# EAGLE design PGA257_socket (EAGLE 9.6.2)
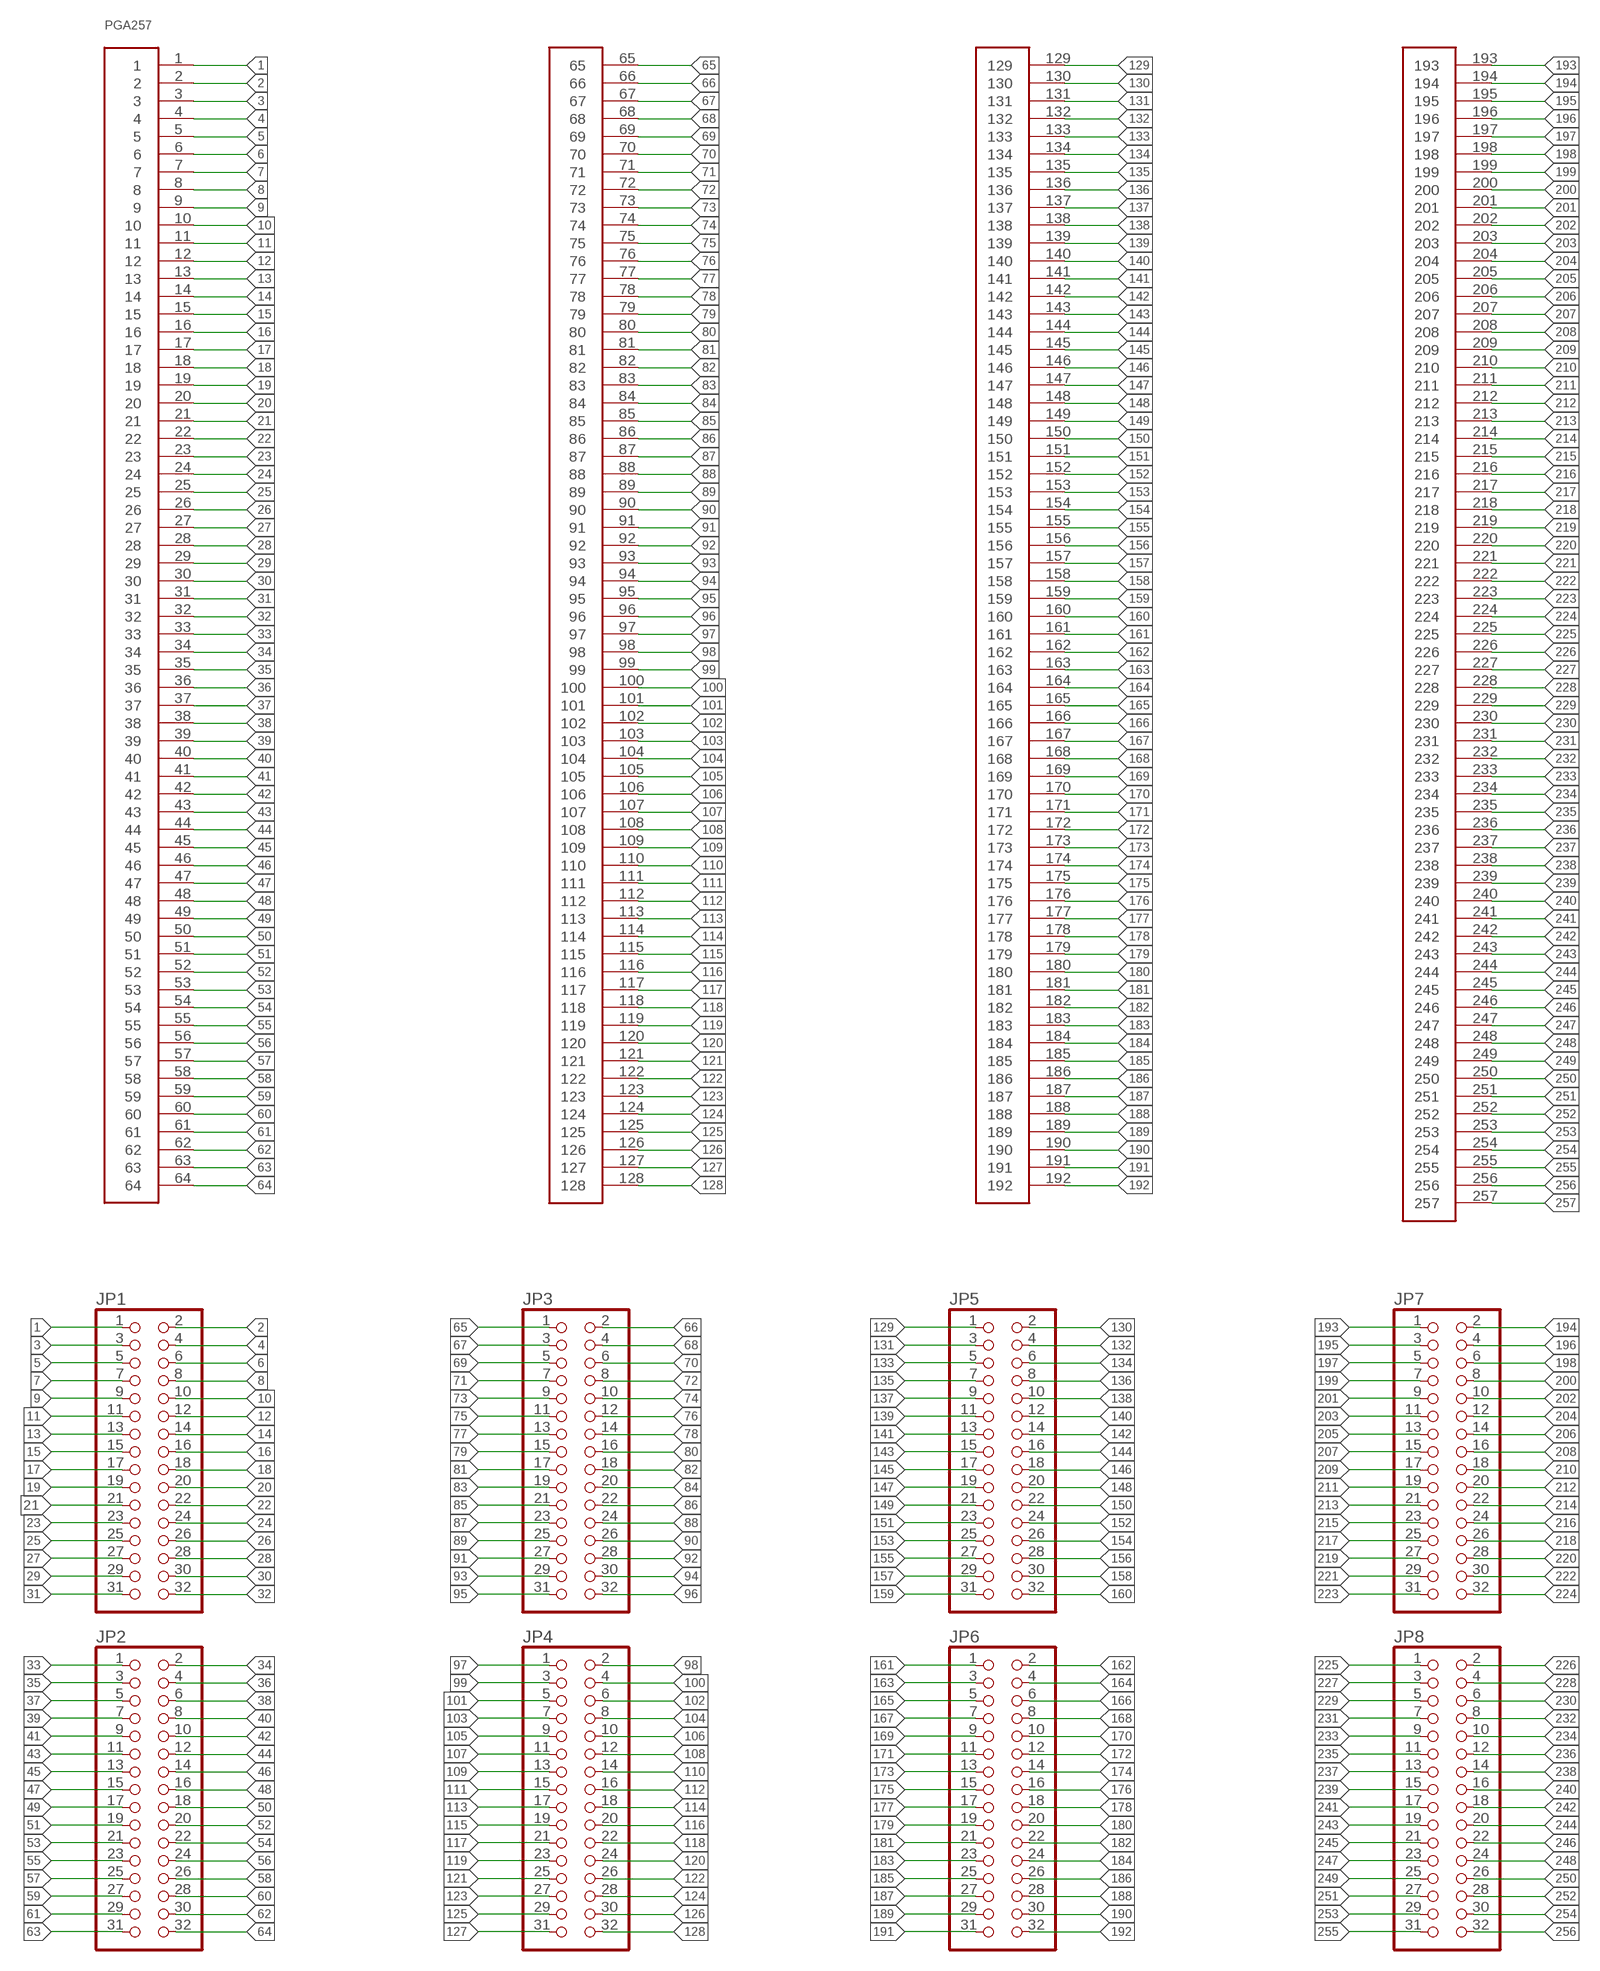
[diagram p0: schematic, sheet 1]

## Parts
JP1  PINHD-2X16  [2X16]
JP2  PINHD-2X16  [2X16]
JP3  PINHD-2X16  [2X16]
JP4  PINHD-2X16  [2X16]
JP5  PINHD-2X16  [2X16]
JP6  PINHD-2X16  [2X16]
JP7  PINHD-2X16  [2X16]
JP8  PINHD-2X16  [2X16]
PGA257  PGA257  [PGA257]

## Nets
1: JP1.1 PGA257.1
2: JP1.2 PGA257.2
3: JP1.3 PGA257.3
4: JP1.4 PGA257.4
5: JP1.5 PGA257.5
6: JP1.6 PGA257.6
7: JP1.7 PGA257.7
8: JP1.8 PGA257.8
9: JP1.9 PGA257.9
10: JP1.10 PGA257.10
11: JP1.11 PGA257.11
12: JP1.12 PGA257.12
13: JP1.13 PGA257.13
14: JP1.14 PGA257.14
15: JP1.15 PGA257.15
16: JP1.16 PGA257.16
17: JP1.17 PGA257.17
18: JP1.18 PGA257.18
19: JP1.19 PGA257.19
20: JP1.20 PGA257.20
21: JP1.21 PGA257.21
22: JP1.22 PGA257.22
23: JP1.23 PGA257.23
24: JP1.24 PGA257.24
25: JP1.25 PGA257.25
26: JP1.26 PGA257.26
27: JP1.27 PGA257.27
28: JP1.28 PGA257.28
29: JP1.29 PGA257.29
30: JP1.30 PGA257.30
31: JP1.31 PGA257.31
32: JP1.32 PGA257.32
33: JP2.1 PGA257.33
34: JP2.2 PGA257.34
35: JP2.3 PGA257.35
36: JP2.4 PGA257.36
37: JP2.5 PGA257.37
38: JP2.6 PGA257.38
39: JP2.7 PGA257.39
40: JP2.8 PGA257.40
41: JP2.9 PGA257.41
42: JP2.10 PGA257.42
43: JP2.11 PGA257.43
44: JP2.12 PGA257.44
45: JP2.13 PGA257.45
46: JP2.14 PGA257.46
47: JP2.15 PGA257.47
48: JP2.16 PGA257.48
49: JP2.17 PGA257.49
50: JP2.18 PGA257.50
51: JP2.19 PGA257.51
52: JP2.20 PGA257.52
53: JP2.21 PGA257.53
54: JP2.22 PGA257.54
55: JP2.23 PGA257.55
56: JP2.24 PGA257.56
57: JP2.25 PGA257.57
58: JP2.26 PGA257.58
59: JP2.27 PGA257.59
60: JP2.28 PGA257.60
61: JP2.29 PGA257.61
62: JP2.30 PGA257.62
63: JP2.31 PGA257.63
64: JP2.32 PGA257.64
65: JP3.1 PGA257.65
66: JP3.2 PGA257.66
67: JP3.3 PGA257.67
68: JP3.4 PGA257.68
69: JP3.5 PGA257.69
70: JP3.6 PGA257.70
71: JP3.7 PGA257.71
72: JP3.8 PGA257.72
73: JP3.9 PGA257.73
74: JP3.10 PGA257.74
75: JP3.11 PGA257.75
76: JP3.12 PGA257.76
77: JP3.13 PGA257.77
78: JP3.14 PGA257.78
79: JP3.15 PGA257.79
80: JP3.16 PGA257.80
81: JP3.17 PGA257.81
82: JP3.18 PGA257.82
83: JP3.19 PGA257.83
84: JP3.20 PGA257.84
85: JP3.21 PGA257.85
86: JP3.22 PGA257.86
87: JP3.23 PGA257.87
88: JP3.24 PGA257.88
89: JP3.25 PGA257.89
90: JP3.26 PGA257.90
91: JP3.27 PGA257.91
92: JP3.28 PGA257.92
93: JP3.29 PGA257.93
94: JP3.30 PGA257.94
95: JP3.31 PGA257.95
96: JP3.32 PGA257.96
97: JP4.1 PGA257.97
98: JP4.2 PGA257.98
99: JP4.3 PGA257.99
100: JP4.4 PGA257.100
101: JP4.5 PGA257.101
102: JP4.6 PGA257.102
103: JP4.7 PGA257.103
104: JP4.8 PGA257.104
105: JP4.9 PGA257.105
106: JP4.10 PGA257.106
107: JP4.11 PGA257.107
108: JP4.12 PGA257.108
109: JP4.13 PGA257.109
110: JP4.14 PGA257.110
111: JP4.15 PGA257.111
112: JP4.16 PGA257.112
113: JP4.17 PGA257.113
114: JP4.18 PGA257.114
115: JP4.19 PGA257.115
116: JP4.20 PGA257.116
117: JP4.21 PGA257.117
118: JP4.22 PGA257.118
119: JP4.23 PGA257.119
120: JP4.24 PGA257.120
121: JP4.25 PGA257.121
122: JP4.26 PGA257.122
123: JP4.27 PGA257.123
124: JP4.28 PGA257.124
125: JP4.29 PGA257.125
126: JP4.30 PGA257.126
127: JP4.31 PGA257.127
128: JP4.32 PGA257.128
129: JP5.1 PGA257.129
130: JP5.2 PGA257.130
131: JP5.3 PGA257.131
132: JP5.4 PGA257.132
133: JP5.5 PGA257.133
134: JP5.6 PGA257.134
135: JP5.7 PGA257.135
136: JP5.8 PGA257.136
137: JP5.9 PGA257.137
138: JP5.10 PGA257.138
139: JP5.11 PGA257.139
140: JP5.12 PGA257.140
141: JP5.13 PGA257.141
142: JP5.14 PGA257.142
143: JP5.15 PGA257.143
144: JP5.16 PGA257.144
145: JP5.17 PGA257.145
146: JP5.18 PGA257.146
147: JP5.19 PGA257.147
148: JP5.20 PGA257.148
149: JP5.21 PGA257.149
150: JP5.22 PGA257.150
151: JP5.23 PGA257.151
152: JP5.24 PGA257.152
153: JP5.25 PGA257.153
154: JP5.26 PGA257.154
155: JP5.27 PGA257.155
156: JP5.28 PGA257.156
157: JP5.29 PGA257.157
158: JP5.30 PGA257.158
159: JP5.31 PGA257.159
160: JP5.32 PGA257.160
161: JP6.1 PGA257.161
162: JP6.2 PGA257.162
163: JP6.3 PGA257.163
164: JP6.4 PGA257.164
165: JP6.5 PGA257.165
166: JP6.6 PGA257.166
167: JP6.7 PGA257.167
168: JP6.8 PGA257.168
169: JP6.9 PGA257.169
170: JP6.10 PGA257.170
171: JP6.11 PGA257.171
172: JP6.12 PGA257.172
173: JP6.13 PGA257.173
174: JP6.14 PGA257.174
175: JP6.15 PGA257.175
176: JP6.16 PGA257.176
177: JP6.17 PGA257.177
178: JP6.18 PGA257.178
179: JP6.19 PGA257.179
180: JP6.20 PGA257.180
181: JP6.21 PGA257.181
182: JP6.22 PGA257.182
183: JP6.23 PGA257.183
184: JP6.24 PGA257.184
185: JP6.25 PGA257.185
186: JP6.26 PGA257.186
187: JP6.27 PGA257.187
188: JP6.28 PGA257.188
189: JP6.29 PGA257.189
190: JP6.30 PGA257.190
191: JP6.31 PGA257.191
192: JP6.32 PGA257.192
193: JP7.1 PGA257.193
194: JP7.2 PGA257.194
195: JP7.3 PGA257.195
196: JP7.4 PGA257.196
197: JP7.5 PGA257.197
198: JP7.6 PGA257.198
199: JP7.7 PGA257.199
200: JP7.8 PGA257.200
201: JP7.9 PGA257.201
202: JP7.10 PGA257.202
203: JP7.11 PGA257.203
204: JP7.12 PGA257.204
205: JP7.13 PGA257.205
206: JP7.14 PGA257.206
207: JP7.15 PGA257.207
208: JP7.16 PGA257.208
209: JP7.17 PGA257.209
210: JP7.18 PGA257.210
211: JP7.19 PGA257.211
212: JP7.20 PGA257.212
213: JP7.21 PGA257.213
214: JP7.22 PGA257.214
215: JP7.23 PGA257.215
216: JP7.24 PGA257.216
217: JP7.25 PGA257.217
218: JP7.26 PGA257.218
219: JP7.27 PGA257.219
220: JP7.28 PGA257.220
221: JP7.29 PGA257.221
222: JP7.30 PGA257.222
223: JP7.31 PGA257.223
224: JP7.32 PGA257.224
225: JP8.1 PGA257.225
226: JP8.2 PGA257.226
227: JP8.3 PGA257.227
228: JP8.4 PGA257.228
229: JP8.5 PGA257.229
230: JP8.6 PGA257.230
231: JP8.7 PGA257.231
232: JP8.8 PGA257.232
233: JP8.9 PGA257.233
234: JP8.10 PGA257.234
235: JP8.11 PGA257.235
236: JP8.12 PGA257.236
237: JP8.13 PGA257.237
238: JP8.14 PGA257.238
239: JP8.15 PGA257.239
240: JP8.16 PGA257.240
241: JP8.17 PGA257.241
242: JP8.18 PGA257.242
243: JP8.19 PGA257.243
244: JP8.20 PGA257.244
245: JP8.21 PGA257.245
246: JP8.22 PGA257.246
247: JP8.23 PGA257.247
248: JP8.24 PGA257.248
249: JP8.25 PGA257.249
250: JP8.26 PGA257.250
251: JP8.27 PGA257.251
252: JP8.28 PGA257.252
253: JP8.29 PGA257.253
254: JP8.30 PGA257.254
255: JP8.31 PGA257.255
256: JP8.32 PGA257.256
257: PGA257.257

## Library data of the parts
JP1-JP8 = pinhead:PINHD-2X16: PIN HEADER
PGA257 = qfp160:PGA257

## Board
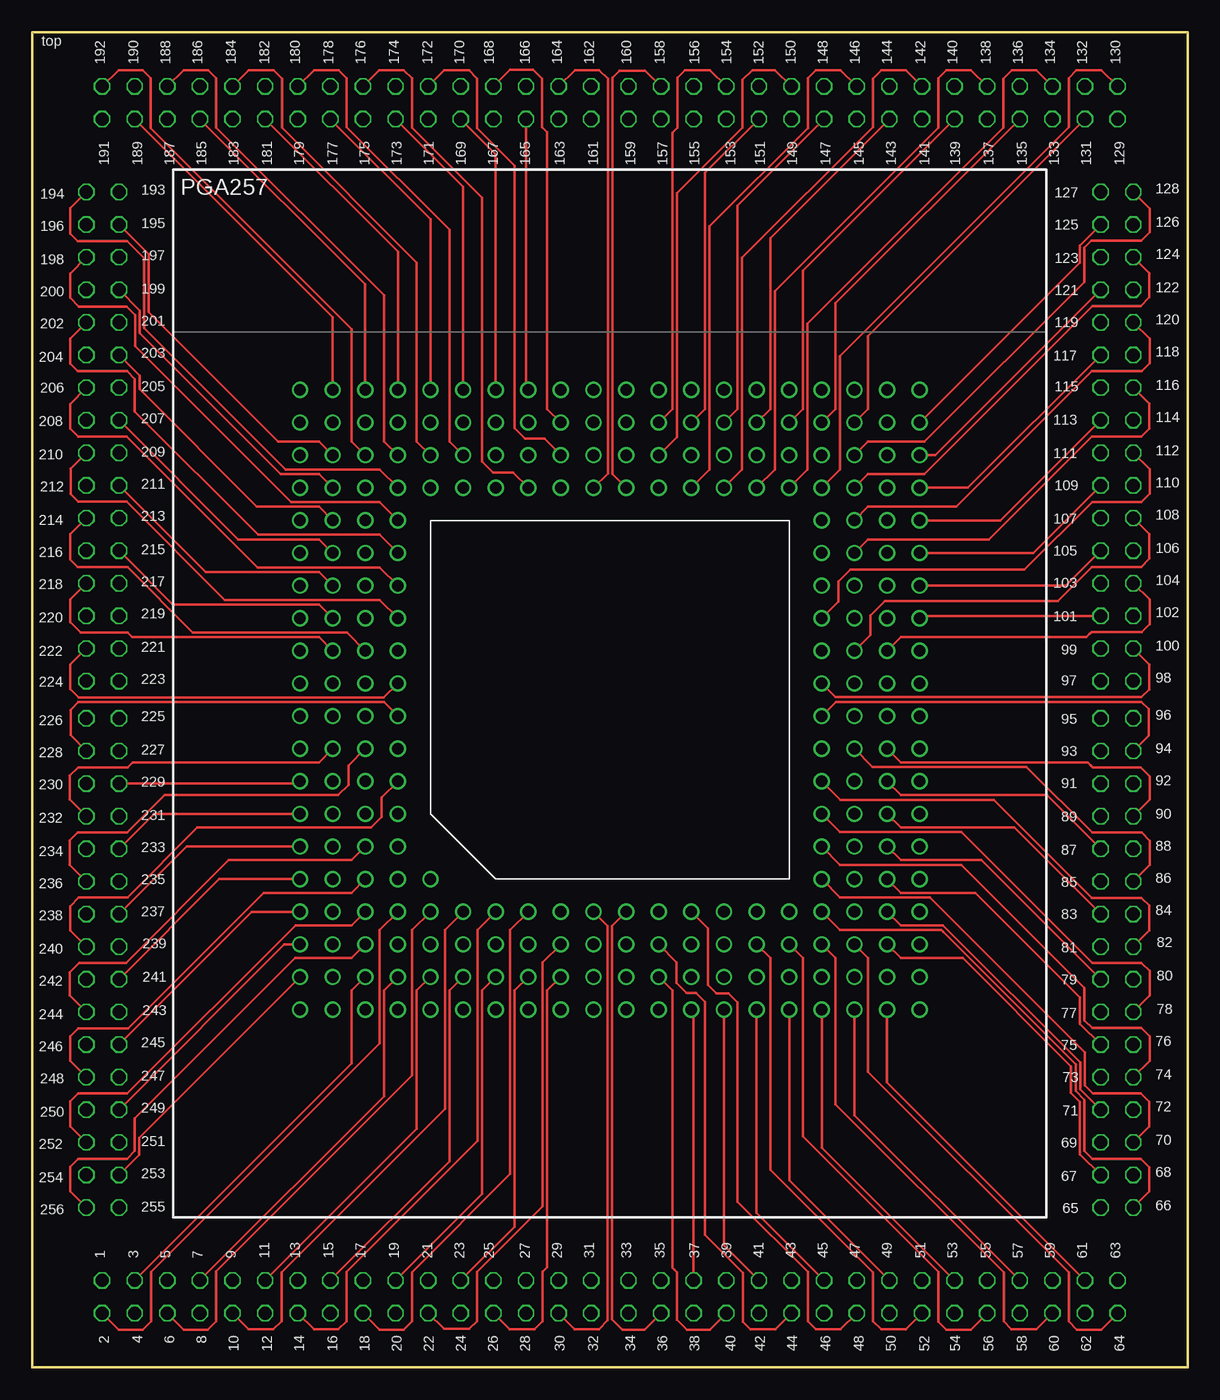
[diagram p1: board, top side]
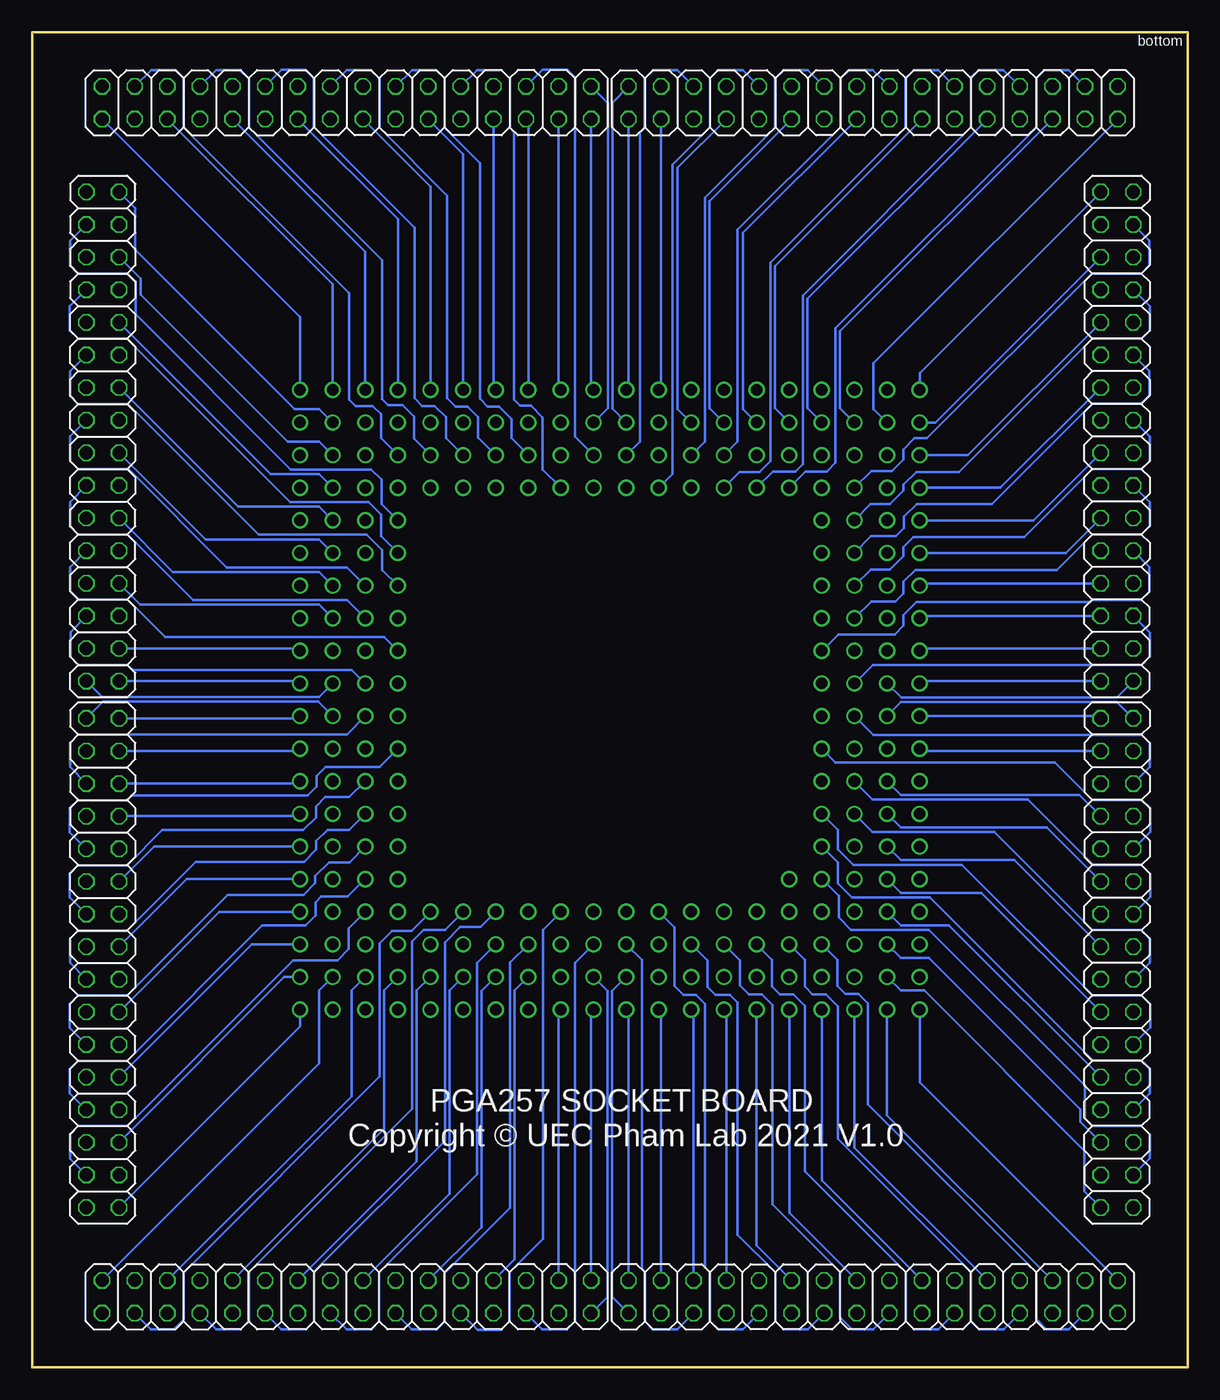
[diagram p2: board, bottom side, seen from below]

Size 90 x 104 mm. Coordinates in mm from the lower left corner, seen from the top.
Outline: 0,0 0,104 90,104 90,0 0,0
Copper layers (1*16): Top 0.035mm / dielectric 1.5mm / Bottom 0.035mm
Design rules "default *": minimum track width 6mil, minimum drill 0.35mm, track to track 6mil, track to pad 0.33mm, pad to pad 10mil, via to via 10mil, smd to smd 10mil, copper to edge 40mil, drill to drill 6mil, minimum pad ring 0.13mm, minimum via ring 0.13mm, stop-mask expansion 4mil, vias tented up to drill 0mil, thermal gap 10mil

### Footprints (pad centres in the part's own frame; a part is rotated, then mirrored left to right if it is on the bottom)
2X16 = drill 1.016 octagon: 1 -19.05,-1.27; 2 -19.05,1.27; 3 -16.51,-1.27; 4 -16.51,1.27; 5 -13.97,-1.27; 6 -13.97,1.27; 7 -11.43,-1.27; 8 -11.43,1.27; 9 -8.89,-1.27; 10 -8.89,1.27; 11 -6.35,-1.27; 12 -6.35,1.27; 13 -3.81,-1.27; 14 -3.81,1.27; 15 -1.27,-1.27; 16 -1.27,1.27; 17 1.27,-1.27; 18 1.27,1.27; 19 3.81,-1.27; 20 3.81,1.27; 21 6.35,-1.27; 22 6.35,1.27; 23 8.89,-1.27; 24 8.89,1.27; 25 11.43,-1.27; 26 11.43,1.27; 27 13.97,-1.27; 28 13.97,1.27; 29 16.51,-1.27; 30 16.51,1.27; 31 19.05,-1.27; 32 19.05,1.27
PGA257 = drill 0.9 pad 1.27: 1 -24.13,-24.13; 2 -16.51,-16.51; 3 -19.05,-21.59; 4 -16.51,-19.05; 5 -21.59,-24.13; 6 -13.97,-16.51; 7 -16.51,-21.59; 8 -13.97,-19.05; 9 -19.05,-24.13; 10 -11.43,-16.51; 11 -13.97,-21.59; 12 -11.43,-19.05; 13 -16.51,-24.13; 14 -8.89,-16.51; 15 -11.43,-21.59; 16 -8.89,-19.05; 17 -13.97,-24.13; 18 -6.35,-16.51; 19 -8.89,-21.59; 20 -6.35,-19.05; 21 -11.43,-24.13; 22 -3.81,-19.05; 23 -6.35,-21.59; 24 -3.81,-16.51; 25 -8.89,-24.13; 26 -3.81,-21.59; 27 -6.35,-24.13; 28 -1.27,-19.05; 29 -3.81,-24.13; 30 -1.27,-16.51; 31 -1.27,-24.13; 32 -1.27,-21.59; 33 1.27,-24.13; 34 1.27,-21.59; 35 3.81,-24.13; 36 1.27,-16.51; 37 6.35,-24.13; 38 1.27,-19.05; 39 6.35,-21.59; 40 3.81,-21.59; 41 8.89,-24.13; 42 3.81,-16.51; 43 8.89,-21.59; 44 3.81,-19.05; 45 11.43,-24.13; 46 6.35,-19.05; 47 11.43,-21.59; 48 6.35,-16.51; 49 13.97,-24.13; 50 8.89,-19.05; 51 13.97,-21.59; 52 11.43,-19.05; 53 16.51,-24.13; 54 8.89,-16.51; 55 16.51,-21.59; 56 13.97,-19.05; 57 19.05,-24.13; 58 11.43,-16.51; 59 19.05,-21.59; 60 16.51,-19.05; 61 21.59,-24.13; 62 13.97,-16.51; 63 21.59,-21.59; 64 19.05,-19.05; 65 24.13,-24.13; 66 16.51,-16.51; 67 21.59,-19.05; 68 19.05,-16.51; 69 24.13,-21.59; 70 16.51,-13.97; 71 21.59,-16.51; 72 19.05,-13.97; 73 24.13,-19.05; 74 16.51,-11.43; 75 21.59,-13.97; 76 19.05,-11.43; 77 24.13,-16.51; 78 16.51,-8.89; 79 21.59,-11.43; 80 19.05,-8.89; 81 24.13,-13.97; 82 16.51,-6.35; 83 21.59,-8.89; 84 19.05,-6.35; 85 24.13,-11.43; 86 19.05,-3.81; 87 21.59,-6.35; 88 16.51,-3.81; 89 24.13,-8.89; 90 21.59,-3.81; 91 24.13,-6.35; 92 19.05,-1.27; 93 24.13,-3.81; 94 16.51,-1.27; 95 24.13,-1.27; 96 21.59,-1.27; 97 24.13,1.27; 98 21.59,1.27; 99 24.13,3.81; 100 16.51,1.27; 101 24.13,6.35; 102 19.05,1.27; 103 21.59,6.35; 104 21.59,3.81; 105 24.13,8.89; 106 16.51,3.81; 107 21.59,8.89; 108 19.05,3.81; 109 24.13,11.43; 110 19.05,6.35; 111 21.59,11.43; 112 16.51,6.35; 113 24.13,13.97; 114 19.05,8.89; 115 21.59,13.97; 116 19.05,11.43; 117 24.13,16.51; 118 16.51,8.89; 119 21.59,16.51; 120 19.05,13.97; 121 24.13,19.05; 122 16.51,11.43; 123 21.59,19.05; 124 19.05,16.51; 125 24.13,21.59; 126 16.51,13.97; 127 21.59,21.59; 128 19.05,19.05; 129 24.13,24.13; 130 16.51,16.51; 131 19.05,21.59; 132 16.51,19.05; 133 21.59,24.13; 134 13.97,16.51; 135 16.51,21.59; 136 13.97,19.05; 137 19.05,24.13; 138 11.43,16.51; 139 13.97,21.59; 140 11.43,19.05; 141 16.51,24.13; 142 8.89,16.51; 143 11.43,21.59; 144 8.89,19.05; 145 13.97,24.13; 146 6.35,16.51; 147 8.89,21.59; 148 6.35,19.05; 149 11.43,24.13; 150 3.81,19.05; 151 6.35,21.59; 152 3.81,16.51; 153 8.89,24.13; 154 3.81,21.59; 155 6.35,24.13; 156 1.27,19.05; 157 3.81,24.13; 158 1.27,16.51; 159 1.27,24.13; 160 1.27,21.59; 161 -1.27,24.13; 162 -1.27,21.59; 163 -3.81,24.13; 164 -1.27,16.51; 165 -6.35,24.13; 166 -1.27,19.05; 167 -6.35,21.59; 168 -3.81,21.59; 169 -8.89,24.13; 170 -3.81,16.51; 171 -8.89,21.59; 172 -3.81,19.05; 173 -11.43,24.13; 174 -6.35,19.05; 175 -11.43,21.59; 176 -6.35,16.51; 177 -13.97,24.13; 178 -8.89,19.05; 179 -13.97,21.59; 180 -11.43,19.05; 181 -16.51,24.13; 182 -8.89,16.51; 183 -16.51,21.59; 184 -13.97,19.05; 185 -19.05,24.13; 186 -11.43,16.51; 187 -19.05,21.59; 188 -16.51,19.05; 189 -21.59,24.13; 190 -13.97,16.51; 191 -21.59,21.59; 192 -19.05,19.05; 193 -24.13,24.13; 194 -16.51,16.51; 195 -21.59,19.05; 196 -19.05,16.51; 197 -24.13,21.59; 198 -16.51,13.97; 199 -21.59,16.51; 200 -19.05,13.97; 201 -24.13,19.05; 202 -16.51,11.43; 203 -21.59,13.97; 204 -19.05,11.43; 205 -24.13,16.51; 206 -16.51,8.89; 207 -21.59,11.43; 208 -19.05,8.89; 209 -24.13,13.97; 210 -16.51,6.35; 211 -21.59,8.89; 212 -19.05,6.35; 213 -24.13,11.43; 214 -19.05,3.81; 215 -21.59,6.35; 216 -16.51,3.81; 217 -24.13,8.89; 218 -21.59,3.81; 219 -24.13,6.35; 220 -19.05,1.27; 221 -24.13,3.81; 222 -16.51,1.27; 223 -24.13,1.27; 224 -21.59,1.27; 225 -24.13,-1.27; 226 -21.59,-1.27; 227 -24.13,-3.81; 228 -16.51,-1.27; 229 -24.13,-6.35; 230 -19.05,-1.27; 231 -21.59,-6.35; 232 -21.59,-3.81; 233 -24.13,-8.89; 234 -16.51,-3.81; 235 -21.59,-8.89; 236 -19.05,-3.81; 237 -24.13,-11.43; 238 -19.05,-6.35; 239 -21.59,-11.43; 240 -16.51,-6.35; 241 -24.13,-13.97; 242 -19.05,-8.89; 243 -21.59,-13.97; 244 -19.05,-11.43; 245 -24.13,-16.51; 246 -16.51,-8.89; 247 -21.59,-16.51; 248 -19.05,-13.97; 249 -24.13,-19.05; 250 -16.51,-11.43; 251 -21.59,-19.05; 252 -19.05,-16.51; 253 -24.13,-21.59; 254 -16.51,-13.97; 255 -21.59,-21.59; 256 -19.05,-19.05; 257 -13.97,-13.97

### Placement (x,y rotation side)
JP1  24.5,5.5 180 bottom
JP2  65.5,5.5 180 bottom
JP3  84.5,31.5 90 bottom
JP4  84.5,72.5 90 bottom
JP5  65.5,98.5 0 bottom
JP6  24.5,98.5 0 bottom
JP7  5.5,72.5 270 bottom
JP8  5.5,31.5 270 bottom
PGA257  45,52 0 top

### Tracks (layer width: path | path; a pad name or v marks a point on that pad's centre or on a via)
1
  Bottom 0.2: JP1.1 20.87,22.19 PGA257.1
2
  Top 0.2: JP1.2 6.73,2.95 8.61,2.95 9.26,3.6 9.26,7.43 27.07,25.24 27.07,34.07 PGA257.2
3
  Top 0.2: JP1.3 24.89,23.66 24.89,29.34 PGA257.3
4
  Bottom 0.2: JP1.4 9.25,2.97 10.99,2.97 11.79,3.77 11.79,7.41 24.89,20.5 24.89,28.34 25.63,29.09 26.66,29.09 27.29,29.72 27.29,31.75 PGA257.4
5
  Bottom 0.2: JP1.5 23.41,19.65 PGA257.5
6
  Top 0.2: JP1.6 11.81,2.95 13.69,2.95 14.34,3.6 14.34,7.48 29.61,22.75 29.61,34.07 PGA257.6
7
  Top 0.2: JP1.7 27.43,21.12 27.43,29.34 PGA257.7
8
  Bottom 0.2: JP1.8 14.32,2.98 16.23,2.98 16.88,3.63 16.88,7.44 27.23,17.78 27.23,28.11 28.18,29.07 29.22,29.07 29.82,29.67 29.82,31.74 PGA257.8
9
  Bottom 0.2: JP1.9 25.95,17.11 PGA257.9
10
  Top 0.2: JP1.10 16.88,2.96 18.78,2.96 19.42,3.6 19.42,7.4 32.15,20.13 32.15,34.07 PGA257.10
11
  Top 0.2: JP1.11 29.96,18.59 29.96,29.34 PGA257.11
12
  Bottom 0.2: JP1.12 19.42,2.96 21.32,2.96 21.95,3.59 21.95,7.4 29.8,15.26 29.8,28.15 30.69,29.04 31.74,29.04 32.36,29.66 32.36,31.74 PGA257.12
13
  Bottom 0.2: JP1.13 28.49,14.57 PGA257.13
14
  Top 0.2: JP1.14 21.96,2.96 23.85,2.96 24.5,3.61 24.5,7.44 34.69,17.63 34.69,34.07 PGA257.14
15
  Top 0.2: JP1.15 32.51,16.05 32.51,29.34 PGA257.15
16
  Bottom 0.2: JP1.16 24.49,2.97 26.14,2.97 27.07,3.9 27.07,7.45 32.34,12.72 32.34,28.23 33.16,29.05 34.16,29.05 34.88,29.77 34.88,31.7 36.11,32.94 PGA257.16
17
  Bottom 0.2: JP1.17 31.03,12.03 PGA257.17
18
  Top 0.2: JP1.18 27.06,2.94 28.92,2.94 29.58,3.6 29.58,7.42 37.23,15.07 37.23,34.07 PGA257.18
19
  Top 0.2: JP1.19 35.05,13.51 35.05,29.34 PGA257.19
20
  Bottom 0.2: JP1.20 29.56,2.98 31.49,2.98 32.11,3.6 32.11,7.41 35.05,10.34 35.05,28.45 35.63,29.03 36.78,29.03 37.4,29.65 37.4,31.7 PGA257.20
21
  Bottom 0.2: JP1.21 33.57,9.49 PGA257.21
22
  Top 0.2: JP1.22 32.09,2.99 34.05,2.99 34.67,3.61 34.67,7.44 39.77,12.54 39.77,31.53 PGA257.22
23
  Top 0.2: PGA257.23 37.59,29.34 37.59,10.97 JP1.23
24
  Bottom 0.2: JP1.24 34.65,2.97 36.55,2.97 37.19,3.61 37.19,7.42 37.59,7.81 37.59,28.31 38.3,29.03 39.28,29.03 39.98,29.73 39.98,34.27 PGA257.24
25
  Bottom 0.2: JP1.25 35.93,27.69 PGA257.25
26
  Top 0.2: JP1.26 37.18,2.98 39.12,2.98 39.75,3.61 39.75,7.43 40.12,7.8 40.12,29.34 PGA257.26
27
  Bottom 0.2: JP1.27 38.47,27.69 PGA257.27
28
  Bottom 0.2: PGA257.28 42.51,31.73 42.51,7.67 42.28,7.45 42.28,3.58 41.66,2.96 39.74,2.96 JP1.28
29
  Bottom 0.2: JP1.29 41.01,27.69 PGA257.29
30
  Top 0.2: JP1.30 42.26,2.98 44.14,2.98 44.82,3.66 44.82,34.4 PGA257.30
31
  Bottom 0.2: JP1.31 43.55,27.69 PGA257.31
32
  Bottom 0.2: JP1.32 44.82,5.5 44.82,29.32 PGA257.32
33
  Bottom 0.2: PGA257.33 46.45,27.69 JP2.1
34
  Bottom 0.2: JP2.2 45.17,5.51 45.17,29.31 PGA257.34
35
  Bottom 0.2: JP2.3 48.99,27.69 PGA257.35
36
  Top 0.2: JP2.4 47.68,2.93 45.98,2.93 45.17,3.74 45.17,34.39 PGA257.36
37
  Top 0.2: JP2.5 51.53,27.69 PGA257.37
38
  Bottom 0.2: JP2.6 50.28,2.98 48.33,2.98 47.72,3.59 47.72,31.5 PGA257.38
39
  Bottom 0.2: PGA257.39 52.41,29.34 52.41,8.42 JP2.7
40
  Top 0.2: JP2.8 52.79,2.95 51,2.95 50.24,3.71 50.24,7.4 50.02,7.62 49.88,7.77 49.88,29.34 PGA257.40
41
  Top 0.2: JP2.9 53.89,9.49 PGA257.41
42
  Bottom 0.2: PGA257.42 50.22,34.08 50.22,30.16 50.22,30.03 50.22,10.01 52.82,7.41 52.82,3.6 53.49,2.93 55.31,2.93 JP2.10
43
  Bottom 0.2: JP2.11 54.99,10.92 54.99,29.3 PGA257.43
44
  Top 0.2: JP2.12 57.88,2.96 55.96,2.96 55.37,3.55 55.37,7.38 52.41,10.34 52.41,28.48 51.73,29.18 50.98,29.18 50.2,29.95 50.2,31.56 PGA257.44
45
  Top 0.2: JP2.13 56.43,12.03 PGA257.45
46
  Bottom 0.2: JP2.14 60.43,2.97 58.47,2.97 57.87,3.57 57.87,7.34 52.77,12.44 52.77,31.53 PGA257.46
47
  Bottom 0.2: JP2.15 57.49,13.51 57.49,29.34 PGA257.47
48
  Top 0.2: JP2.16 62.96,2.96 61.05,2.96 60.41,3.6 60.41,7.45 54.95,12.91 54.95,28.43 54.24,29.14 53.32,29.14 52.65,29.81 52.65,34.19 PGA257.48
49
  Top 0.2: JP2.17 58.97,14.57 PGA257.49
50
  Bottom 0.2: JP2.18 65.52,2.98 63.57,2.98 62.97,3.58 62.97,7.4 55.35,15.02 55.35,31.49 PGA257.50
51
  Bottom 0.2: JP2.19 60.03,16.05 60.03,29.34 PGA257.51
52
  Top 0.2: JP2.20 68.04,2.96 66.14,2.96 65.49,3.61 65.49,7.41 57.49,15.41 57.49,31.89 PGA257.52
53
  Top 0.2: JP2.21 61.51,17.11 PGA257.53
54
  Bottom 0.2: JP2.22 70.59,2.97 68.67,2.97 68.04,3.6 68.04,7.47 57.85,17.66 57.85,22.56 57.85,23.26 57.85,33.1 56.65,34.3 55.08,34.3 PGA257.54
55
  Bottom 0.2: JP2.23 62.58,18.59 62.58,29.34 PGA257.55
56
  Top 0.2: JP2.24 73.11,2.95 71.21,2.95 70.59,3.57 70.59,7.45 60.03,18.01 60.03,31.89 PGA257.56
57
  Top 0.2: JP2.25 64.05,19.65 PGA257.57
58
  Bottom 0.2: JP2.26 75.66,2.96 73.74,2.96 73.11,3.59 73.11,7.43 60.39,20.15 60.39,33.19 59.51,34.07 57.85,34.07 PGA257.58
59
  Bottom 0.2: JP2.27 65.11,21.12 65.11,29.34 PGA257.59
60
  Top 0.2: JP2.28 78.21,2.97 76.29,2.97 75.68,3.58 75.68,7.39 62.58,20.5 62.58,31.89 PGA257.60
61
  Top 0.2: JP2.29 66.59,22.19 PGA257.61
62
  Bottom 0.2: JP2.30 80.75,2.97 78.97,2.97 78.21,3.73 78.21,7.38 62.93,22.66 62.93,33.04 61.95,34.02 60.45,34.02 PGA257.62
63
  Bottom 0.2: JP2.31 67.66,23.66 67.66,29.34 PGA257.63
64
  Top 0.2: JP2.32 83.27,2.95 81.39,2.95 80.74,3.6 80.74,7.39 65.11,23.02 65.11,31.89 PGA257.64
65
  Bottom 0.2: JP3.1 69.13,26.55 PGA257.65
66
  Top 0.2: JP3.2 87.03,13.71 87.03,15.59 86.36,16.26 82.57,16.26 81.97,16.86 81.97,20.83 81.28,21.53 81.28,23.6 70.98,33.9 70.94,33.94 70.81,34.07 62.93,34.07 PGA257.66
67
  Top 0.2: JP3.3 81.62,16.6 81.62,20.69 80.92,21.38 80.92,23.46 72.5,31.89 67.66,31.89 PGA257.67
68
  Bottom 0.2: JP3.4 87.04,16.26 87.04,18.19 86.42,18.81 82.55,18.81 69.66,31.7 66.22,31.7 65.34,32.58 65.34,34.2 PGA257.68
69
  Bottom 0.2: JP3.5 70.35,30.41 PGA257.69
70
  Top 0.2: JP3.6 87.03,18.79 87.03,20.67 86.37,21.33 82.61,21.33 81.98,21.96 81.98,24.54 69.91,36.61 62.93,36.61 PGA257.70
71
  Top 0.2: JP3.7 81.63,21.67 81.63,23.75 70.95,34.42 67.66,34.42 PGA257.71
72
  Bottom 0.2: JP3.8 87.06,21.36 87.06,23.25 86.43,23.88 82.61,23.88 72.06,34.42 68.69,34.42 67.93,35.18 67.93,36.23 67.49,36.67 65.41,36.67 PGA257.72
73
  Bottom 0.2: JP3.9 72.89,32.95 PGA257.73
74
  Top 0.2: JP3.10 87.04,23.88 87.04,25.79 86.4,26.43 82.58,26.43 81.97,27.04 81.97,29.57 72.39,39.15 62.93,39.15 PGA257.74
75
  Top 0.2: JP3.11 81.62,26.76 81.62,28.83 73.48,36.97 67.66,36.97 PGA257.75
76
  Bottom 0.2: JP3.12 87.06,26.44 87.06,28.32 86.42,28.96 82.6,28.96 74.76,36.8 68.85,36.8 67.94,37.71 67.94,38.26 66.86,39.34 65.28,39.34 PGA257.76
77
  Bottom 0.2: JP3.13 75.43,35.49 PGA257.77
78
  Top 0.2: JP3.14 87.05,28.97 87.05,30.88 86.41,31.52 82.57,31.52 72.4,41.69 62.93,41.69 PGA257.78
79
  Top 0.2: JP3.15 73.95,39.51 67.66,39.51 PGA257.79
80
  Bottom 0.2: JP3.16 87.03,31.49 87.03,33.42 86.44,34.01 82.62,34.01 77.26,39.37 68.82,39.37 67.86,40.33 67.86,40.99 66.99,41.86 65.3,41.86 PGA257.80
81
  Bottom 0.2: JP3.17 77.97,38.03 PGA257.81
82
  Top 0.2: JP3.18 87.02,34.02 87.02,35.97 86.41,36.58 82.52,36.58 74.91,44.2 62.97,44.2 PGA257.82
83
  Top 0.2: JP3.19 76.5,42.05 67.66,42.05 PGA257.83
84
  Bottom 0.2: JP3.20 87.07,36.61 87.07,38.48 86.44,39.11 82.6,39.11 79.85,41.86 68.87,41.86 67.89,42.84 67.89,43.7 67.18,44.41 65.29,44.41 PGA257.84
85
  Bottom 0.2: JP3.21 80.51,40.57 PGA257.85
86
  Top 0.2: JP3.22 87.07,39.15 87.07,41.02 86.43,41.66 82.57,41.66 77.46,46.77 65.47,46.77 PGA257.86
87
  Top 0.2: JP3.23 79.03,44.59 67.66,44.59 PGA257.87
88
  Bottom 0.2: JP3.24 87.06,41.68 87.06,43.56 86.45,44.17 82.6,44.17 82.23,44.54 68.55,44.54 67.85,45.24 67.85,46.06 67.13,46.78 62.92,46.78 PGA257.88
89
  Bottom 0.2: JP3.25 69.31,42.93 PGA257.89
90
  Top 0.2: JP3.26 87.07,44.23 87.07,46.04 86.37,46.74 82.61,46.74 82.49,46.86 82.42,46.93 82.22,47.12 67.66,47.12 PGA257.90
91
  Bottom 0.2: JP3.27 69.31,45.47 PGA257.91
92
  Bottom 0.2: JP3.28 87.05,46.75 87.05,48.64 86.39,49.3 65.48,49.3 PGA257.92
93
  Bottom 0.2: JP3.29 69.31,48.01 PGA257.93
94
  Top 0.2: PGA257.94 62.62,51.84 86.39,51.84 86.96,51.27 86.96,49.2 JP3.30
95
  Bottom 0.2: JP3.31 69.31,50.55 PGA257.95
96
  Bottom 0.2: JP3.32 84.47,51.85 67.71,51.85 PGA257.96
97
  Bottom 0.2: JP4.1 69.31,53.45 PGA257.97
98
  Bottom 0.2: JP4.2 84.52,52.2 67.66,52.2 PGA257.98
99
  Bottom 0.2: PGA257.99 69.31,55.99 JP4.3
100
  Top 0.2: JP4.4 87.01,54.75 87.01,52.81 86.41,52.2 62.58,52.2 PGA257.100
101
  Top 0.2: PGA257.101 69.31,58.53 JP4.5
102
  Bottom 0.2: JP4.6 87.01,57.29 87.01,55.33 86.38,54.7 82.54,54.7 82.25,54.41 82.17,54.34 65.11,54.34 PGA257.102
103
  Bottom 0.2: JP4.7 81.58,59.41 67.66,59.41 PGA257.103
104
  Top 0.2: JP4.8 87.05,59.79 87.05,57.89 86.44,57.28 82.52,57.28 82.36,57.12 82.12,56.88 67.66,56.88 PGA257.104
105
  Top 0.2: JP4.9 80.51,60.89 PGA257.105
106
  Bottom 0.2: JP4.10 87.04,62.34 87.04,60.47 86.36,59.79 82.54,59.79 79.62,56.88 62.58,56.88 PGA257.106
107
  Bottom 0.2: JP4.11 79.03,61.95 67.66,61.95 PGA257.107
108
  Top 0.2: JP4.12 87.02,64.9 87.02,62.98 86.38,62.34 82.55,62.34 79.88,59.67 66.41,59.67 65.28,58.55 65.28,57.04 PGA257.108
109
  Top 0.2: JP4.13 77.97,63.43 PGA257.109
110
  Bottom 0.2: JP4.14 87.05,67.41 87.05,65.5 86.42,64.87 82.57,64.87 77.47,59.77 65.47,59.77 PGA257.110
111
  Bottom 0.2: JP4.15 76.5,64.5 67.66,64.5 PGA257.111
112
  Top 0.2: JP4.16 87.04,69.96 87.04,68.05 86.4,67.41 82.56,67.41 77.28,62.13 63.72,62.13 62.81,61.22 62.81,59.65 PGA257.112
113
  Top 0.2: JP4.17 75.43,65.97 PGA257.113
114
  Bottom 0.2: JP4.18 87.02,72.52 87.02,70.57 86.41,69.96 82.48,69.96 74.83,62.31 65.47,62.31 PGA257.114
115
  Bottom 0.2: JP4.19 73.95,67.03 67.66,67.03 PGA257.115
116
  Top 0.2: JP4.20 87.02,75.06 87.02,73.12 86.4,72.5 82.53,72.5 74.53,64.5 65.11,64.5 PGA257.116
117
  Top 0.2: JP4.21 72.89,68.51 PGA257.117
118
  Bottom 0.2: JP4.22 87.03,77.59 87.03,75.63 86.43,75.03 82.53,75.03 72.35,64.85 63.94,64.85 62.74,63.65 62.74,62.12 PGA257.118
119
  Bottom 0.2: JP4.23 71.41,69.58 67.66,69.58 PGA257.119
120
  Top 0.2: JP4.24 87.04,80.12 87.04,78.21 86.42,77.59 82.55,77.59 72,67.03 65.11,67.03 PGA257.120
121
  Top 0.2: JP4.25 70.35,71.05 PGA257.121
122
  Bottom 0.2: JP4.26 87.06,82.64 87.06,80.76 86.42,80.12 82.62,80.12 69.89,67.39 63.78,67.39 62.81,66.42 62.81,64.73 PGA257.122
123
  Bottom 0.2: JP4.27 81.56,84.8 81.56,83.56 70.11,72.11 67.66,72.11 PGA257.123
124
  Top 0.2: JP4.28 87.03,85.21 87.03,83.35 86.34,82.66 82.57,82.66 69.48,69.58 65.11,69.58 PGA257.124
125
  Top 0.2: JP4.29 81.59,87.37 81.59,86.05 PGA257.125
126
  Bottom 0.2: JP4.30 87.04,87.74 87.04,85.79 86.44,85.19 82.56,85.19 81.93,84.56 81.93,84.47 81.95,84.45 81.95,82.02 69.86,69.93 63.58,69.93 62.79,69.14 62.79,67.25 PGA257.126
127
  Bottom 0.2: JP4.31 81.97,90.29 81.97,87.06 69.56,74.66 67.66,74.66 PGA257.127
128
  Top 0.2: JP4.32 87.07,90.25 87.07,88.43 86.39,87.75 82.49,87.75 81.94,87.2 81.94,84.54 69.52,72.11 65.11,72.11 PGA257.128
129
  Bottom 0.2: JP5.1 69.13,81.81 PGA257.129
130
  Top 0.2: JP5.2 83.29,101.03 81.35,101.03 80.74,100.42 80.74,96.59 62.93,78.78 62.93,69.93 PGA257.130
131
  Top 0.2: JP5.3 65.11,80.34 65.11,74.66 PGA257.131
132
  Bottom 0.2: JP5.4 80.73,101.05 78.84,101.05 78.19,100.4 78.19,96.54 65.32,83.67 65.32,75.37 64.81,74.86 63.46,74.86 62.83,74.23 62.83,72.37 PGA257.132
133
  Bottom 0.2: JP5.5 66.59,84.35 PGA257.133
134
  Top 0.2: JP5.6 78.2,101.04 76.33,101.04 75.66,100.37 75.66,96.56 60.39,81.29 60.39,69.93 PGA257.134
135
  Top 0.2: JP5.7 62.58,82.88 62.58,74.66 PGA257.135
136
  Bottom 0.2: JP5.8 75.66,101.04 73.82,101.04 73.1,100.32 73.1,96.57 62.75,86.22 62.75,75.43 62.27,74.95 61.15,74.95 60.26,74.06 60.26,72.34 PGA257.136
137
  Bottom 0.2: JP5.9 64.05,86.89 PGA257.137
138
  Top 0.2: JP5.10 73.13,101.03 71.2,101.03 70.58,100.41 70.58,96.57 57.85,83.84 57.85,69.93 PGA257.138
139
  Top 0.2: JP5.11 60.03,85.41 60.03,74.66 PGA257.139
140
  Bottom 0.2: JP5.12 70.55,101.07 68.74,101.07 68.06,100.39 68.06,96.62 60.22,88.78 60.22,75.48 59.62,74.88 58.65,74.88 57.77,74 57.77,72.39 PGA257.140
141
  Bottom 0.2: JP5.13 61.51,89.43 PGA257.141
142
  Top 0.2: JP5.14 68.04,101.04 66.15,101.04 65.49,100.38 65.49,96.6 55.31,86.42 55.31,69.93 PGA257.142
143
  Top 0.2: JP5.15 57.49,87.95 57.49,74.66 PGA257.143
144
  Bottom 0.2: JP5.16 65.5,101.04 63.62,101.04 62.95,100.37 62.95,96.55 57.67,91.27 57.67,75.5 57.02,74.85 56.1,74.85 55.25,74 55.25,72.41 PGA257.144
145
  Bottom 0.2: JP5.17 58.97,91.97 PGA257.145
146
  Top 0.2: JP5.18 62.97,101.03 61.04,101.03 60.42,100.41 60.42,96.53 52.77,88.88 52.77,69.93 PGA257.146
147
  Top 0.2: JP5.19 54.95,90.5 54.95,74.66 PGA257.147
148
  Bottom 0.2: JP5.20 60.41,101.05 58.52,101.05 57.89,100.42 57.89,96.57 55.12,93.8 55.12,75.44 54.53,74.85 53.64,74.85 52.66,73.87 52.66,72.36 PGA257.148
149
  Bottom 0.2: JP5.21 56.43,94.51 PGA257.149
150
  Top 0.2: JP5.22 57.87,101.05 56.11,101.05 55.34,100.28 55.34,96.55 50.23,91.44 50.23,72.47 PGA257.150
151
  Top 0.2: JP5.23 52.41,93.03 52.41,74.66 PGA257.151
152
  Bottom 0.2: JP5.24 55.34,101.04 53.45,101.04 52.79,100.38 52.79,96.55 52.46,96.22 52.46,75.38 51.98,74.9 51.15,74.9 50.23,73.98 50.23,69.93 PGA257.152
153
  Bottom 0.2: JP5.25 54.07,76.31 PGA257.153
154
  Top 0.2: JP5.26 52.81,101.03 50.85,101.03 50.27,100.45 50.27,96.56 49.88,96.16 49.88,74.66 PGA257.154
155
  Bottom 0.2: JP5.27 51.35,97.05 PGA257.155
156
  Bottom 0.2: JP5.28 50.23,101.07 48.3,101.07 47.73,100.5 47.73,72.51 PGA257.156
157
  Bottom 0.2: JP5.29 48.99,76.31 PGA257.157
158
  Top 0.2: PGA257.158 45.19,69.59 45.19,100.43 45.77,101.01 47.75,101.01 JP5.30
159
  Bottom 0.2: JP5.31 46.45,76.31 PGA257.159
160
  Bottom 0.2: JP5.32 45.16,98.48 45.16,74.7 PGA257.160
161
  Bottom 0.2: JP6.1 43.55,76.31 PGA257.161
162
  Bottom 0.2: JP6.2 44.81,98.51 44.81,74.67 PGA257.162
163
  Bottom 0.2: JP6.3 41.01,76.31 PGA257.163
164
  Top 0.2: PGA257.164 44.84,69.62 44.84,100.35 44.14,101.05 42.29,101.05 JP6.4
165
  Top 0.2: JP6.5 38.47,76.31 PGA257.165
166
  Bottom 0.2: PGA257.166 42.66,72.11 42.66,96.17 42.31,96.53 42.31,100.35 41.61,101.05 39.75,101.05 JP6.6
167
  Bottom 0.2: PGA257.167 39.72,74.66 39.72,93.44 JP6.7
168
  Top 0.2: JP6.8 37.22,101.06 39.02,101.06 39.73,100.35 39.73,96.6 40.12,96.2 40.12,74.66 PGA257.168
169
  Top 0.2: JP6.9 36.11,94.51 PGA257.169
170
  Bottom 0.2: JP6.10 34.65,101.03 36.59,101.03 37.2,100.42 37.2,96.61 40.12,93.69 40.12,69.58 PGA257.170
171
  Bottom 0.2: JP6.11 37.23,90.85 37.23,74.71 PGA257.171
172
  Top 0.2: JP6.12 32.1,101.02 34.02,101.02 34.67,100.37 34.67,96.51 37.59,93.59 37.59,73.15 38.39,72.34 39.9,72.34 PGA257.172
173
  Top 0.2: JP6.13 33.57,91.97 PGA257.173
174
  Bottom 0.2: JP6.14 29.58,101.04 31.46,101.04 32.13,100.37 32.13,96.55 37.59,91.09 37.59,72.11 PGA257.174
175
  Bottom 0.2: JP6.15 34.63,88.37 34.63,74.66 PGA257.175
176
  Top 0.2: JP6.16 27.04,101.04 28.95,101.04 29.6,100.39 29.6,96.55 35.05,91.1 35.05,70.56 35.91,69.69 37.47,69.69 PGA257.176
177
  Top 0.2: JP6.17 31.03,89.43 PGA257.177
178
  Bottom 0.2: JP6.18 24.51,101.05 26.36,101.05 27.06,100.35 27.06,96.58 35.05,88.59 35.05,72.11 PGA257.178
179
  Bottom 0.2: JP6.19 32.15,85.77 32.15,74.71 PGA257.179
180
  Top 0.2: JP6.20 21.96,101.04 23.88,101.04 24.51,100.41 24.51,96.59 32.51,88.59 32.51,72.11 PGA257.180
181
  Top 0.2: JP6.21 28.49,86.89 PGA257.181
182
  Bottom 0.2: JP6.22 19.43,101.05 21.33,101.05 21.98,100.4 21.98,96.57 32.51,86.05 32.51,70.58 33.36,69.72 34.9,69.72 PGA257.182
183
  Bottom 0.2: JP6.23 29.61,83.23 29.61,74.71 PGA257.183
184
  Top 0.2: JP6.24 16.88,101.04 18.8,101.04 19.46,100.38 19.46,96.56 29.96,86.06 29.96,72.11 PGA257.184
185
  Top 0.2: JP6.25 25.95,84.35 PGA257.185
186
  Bottom 0.2: PGA257.186 32.31,69.77 30.56,69.77 29.96,70.36 29.96,83.48 16.87,96.58 16.87,100.47 16.29,101.05 14.35,101.05 JP6.26
187
  Bottom 0.2: PGA257.187 27.07,74.71 27.07,80.69 JP6.27
188
  Top 0.2: JP6.28 11.8,101.04 13.7,101.04 14.35,100.39 14.35,96.57 27.43,83.5 27.43,72.11 PGA257.188
189
  Top 0.2: JP6.29 23.41,81.81 PGA257.189
190
  Bottom 0.2: PGA257.190 29.75,69.79 28.11,69.79 27.42,70.48 27.42,80.93 11.78,96.57 11.78,100.46 11.19,101.05 9.27,101.05 JP6.30
191
  Bottom 0.2: JP6.31 24.48,78.2 24.48,74.66 PGA257.191
192
  Top 0.2: JP6.32 6.73,101.05 8.61,101.05 9.25,100.41 9.25,96.51 24.89,80.88 24.89,72.11 PGA257.192
193
  Bottom 0.2: JP7.1 20.87,77.45 PGA257.193
194
  Top 0.2: JP7.2 2.98,90.3 2.98,88.32 3.57,87.73 7.4,87.73 8.73,86.4 8.73,80.94 19.75,69.93 27.07,69.93 PGA257.194
195
  Top 0.2: JP7.3 9.09,86.69 9.09,82.18 19.15,72.11 22.34,72.11 PGA257.195
196
  Bottom 0.2: JP7.4 2.97,87.75 2.97,85.84 3.61,85.2 7.46,85.2 20.3,72.36 21.27,72.36 22.15,71.48 22.15,70.72 23.05,69.82 24.64,69.82 PGA257.196
197
  Bottom 0.2: JP7.5 19.65,73.59 PGA257.197
198
  Top 0.2: JP7.6 2.96,85.2 2.96,83.31 3.64,82.63 7.36,82.63 8.03,81.96 8.03,79.53 20.17,67.39 27.07,67.39 PGA257.198
199
  Top 0.2: JP7.7 8.38,82.32 8.38,80.54 19.35,69.58 22.34,69.58 PGA257.199
200
  Bottom 0.2: JP7.8 2.96,82.66 2.96,80.74 3.56,80.14 7.42,80.14 17.81,69.75 21.14,69.75 22.13,68.76 22.13,68.28 23.18,67.23 24.69,67.23 PGA257.200
201
  Bottom 0.2: JP7.9 17.11,71.05 PGA257.201
202
  Top 0.2: JP7.10 2.97,80.13 2.97,78.18 3.56,77.59 7.39,77.59 8.01,76.97 8.01,74.43 17.59,64.85 27.07,64.85 PGA257.202
203
  Top 0.2: JP7.11 8.36,77.26 8.36,76.18 17.51,67.03 22.34,67.03 PGA257.203
204
  Bottom 0.2: JP7.12 2.97,77.59 2.97,75.71 3.63,75.05 7.44,75.05 15.24,67.25 21.1,67.25 22.08,66.27 22.08,65.38 22.73,64.73 24.65,64.73 PGA257.204
205
  Bottom 0.2: JP7.13 14.57,68.51 PGA257.205
206
  Top 0.2: JP7.14 2.95,75.03 2.95,73.13 3.58,72.5 7.37,72.5 17.56,62.31 27.07,62.31 PGA257.206
207
  Top 0.2: JP7.15 16.05,64.5 22.34,64.5 PGA257.207
208
  Bottom 0.2: JP7.16 2.95,72.49 2.95,70.58 3.58,69.95 7.43,69.95 12.7,64.68 21.35,64.68 22.13,63.9 22.13,63.2 23.17,62.16 24.68,62.16 PGA257.208
209
  Bottom 0.2: JP7.17 12.03,65.97 PGA257.209
210
  Top 0.2: JP7.18 3,70 3,68.03 3.6,67.43 7.36,67.43 15,59.78 27.05,59.78 PGA257.210
211
  Top 0.2: JP7.19 13.5,61.95 22.34,61.95 PGA257.211
212
  Bottom 0.2: JP7.20 2.95,67.41 2.95,65.52 3.59,64.88 7.41,64.88 10.17,62.12 21.22,62.12 22.15,61.19 22.15,60.26 22.75,59.66 24.64,59.66 PGA257.212
213
  Bottom 0.2: JP7.21 9.49,63.43 PGA257.213
214
  Top 0.2: JP7.22 2.97,64.89 2.97,62.92 3.57,62.32 7.43,62.32 12.52,57.23 24.53,57.23 PGA257.214
215
  Top 0.2: JP7.23 10.97,59.41 22.34,59.41 PGA257.215
216
  Bottom 0.2: JP7.24 2.97,62.35 2.97,60.42 3.63,59.76 7.42,59.76 7.58,59.6 21.13,59.6 22.12,58.61 22.12,57.77 22.8,57.09 27.21,57.09 PGA257.216
217
  Bottom 0.2: JP7.25 20.69,61.07 PGA257.217
218
  Top 0.2: JP7.26 2.97,59.81 2.97,58.06 3.78,57.25 7.43,57.25 7.8,56.88 22.34,56.88 PGA257.218
219
  Bottom 0.2: JP7.27 20.69,58.53 PGA257.219
220
  Bottom 0.2: JP7.28 2.95,57.25 2.95,55.35 3.58,54.72 24.5,54.72 PGA257.220
221
  Bottom 0.2: JP7.29 20.69,55.99 PGA257.221
222
  Top 0.2: PGA257.222 27.39,52.17 3.62,52.17 2.97,52.82 2.97,54.73 JP7.30
223
  Bottom 0.2: JP7.31 20.69,53.45 PGA257.223
224
  Bottom 0.2: JP7.32 5.51,52.17 22.31,52.17 PGA257.224
225
  Bottom 0.2: JP8.1 6.95,50.73 PGA257.225
226
  Bottom 0.2: JP8.2 5.5,51.82 22.32,51.82 PGA257.226
227
  Bottom 0.2: JP8.3 20.69,48.01 PGA257.227
228
  Top 0.2: PGA257.228 27.4,51.82 3.61,51.82 2.99,51.2 2.99,49.25 JP8.4
229
  Top 0.2: JP8.5 20.69,45.47 PGA257.229
230
  Bottom 0.2: JP8.6 2.95,46.75 2.95,48.65 3.57,49.27 24.49,49.27 PGA257.230
231
  Bottom 0.2: JP8.7 8.42,44.59 22.34,44.59 PGA257.231
232
  Top 0.2: JP8.8 2.94,44.22 2.94,46.09 3.59,46.74 7.45,46.74 7.84,47.12 22.34,47.12 PGA257.232
233
  Top 0.2: JP8.9 9.49,43.11 PGA257.233
234
  Bottom 0.2: JP8.10 2.92,41.7 2.92,43.57 3.56,44.21 7.41,44.21 10.33,47.12 27.43,47.12 PGA257.234
235
  Bottom 0.2: JP8.11 10.97,42.05 22.34,42.05 PGA257.235
236
  Top 0.2: JP8.12 2.93,39.15 2.93,41.04 3.54,41.65 7.41,41.65 10.34,44.59 23.85,44.59 24.64,45.37 24.64,46.88 PGA257.236
237
  Top 0.2: JP8.13 12.03,40.57 PGA257.237
238
  Bottom 0.2: JP8.14 2.91,36.63 2.91,38.45 3.59,39.13 7.33,39.13 12.43,44.23 24.53,44.23 PGA257.238
239
  Bottom 0.2: JP8.15 13.5,39.51 22.34,39.51 PGA257.239
240
  Top 0.2: JP8.16 2.96,34.04 2.96,35.92 3.64,36.6 7.43,36.6 12.88,42.05 26.39,42.05 27.22,42.87 27.22,44.38 PGA257.240
241
  Top 0.2: JP8.17 14.57,38.03 PGA257.241
242
  Bottom 0.2: JP8.18 2.94,31.52 2.94,33.39 3.61,34.06 7.42,34.06 15.05,41.69 24.53,41.69 PGA257.242
243
  Bottom 0.2: JP8.19 16.05,36.97 22.34,36.97 PGA257.243
244
  Top 0.2: JP8.20 2.93,28.99 2.93,30.77 3.68,31.52 7.33,31.52 15.32,39.51 24.89,39.51 PGA257.244
245
  Top 0.2: JP8.21 17.11,35.49 PGA257.245
246
  Bottom 0.2: JP8.22 2.91,26.47 2.91,28.3 3.57,28.96 7.39,28.96 17.58,39.15 26.04,39.15 27.22,40.33 27.22,41.84 PGA257.246
247
  Bottom 0.2: JP8.23 18.59,34.42 22.34,34.42 PGA257.247
248
  Top 0.2: JP8.24 2.95,23.89 2.95,25.79 3.58,26.42 7.48,26.42 18.02,36.97 24.89,36.97 PGA257.248
249
  Top 0.2: JP8.25 19.65,32.95 PGA257.249
250
  Bottom 0.2: JP8.26 2.96,21.34 2.96,23.28 3.58,23.9 7.37,23.9 20.08,36.61 26.15,36.61 27.24,37.7 27.24,39.32 PGA257.250
251
  Bottom 0.2: JP8.27 8.36,19.12 8.36,20.11 20.14,31.89 22.34,31.89 PGA257.251
252
  Top 0.2: JP8.28 2.97,18.79 2.97,20.71 3.59,21.33 7.42,21.33 20.52,34.42 24.89,34.42 PGA257.252
253
  Top 0.2: JP8.29 8.35,16.57 8.35,17.89 PGA257.253
254
  Bottom 0.2: JP8.30 2.94,16.28 2.94,18.16 3.59,18.81 7.44,18.81 8.01,19.38 8.01,21.95 20.13,34.07 26.21,34.07 27.17,35.03 27.17,36.71 PGA257.254
255
  Bottom 0.2: JP8.31 8.03,13.71 8.03,16.87 20.5,29.34 22.34,29.34 PGA257.255
256
  Top 0.2: JP8.32 2.97,13.71 2.97,15.64 3.58,16.25 7.4,16.25 8,16.85 8,19.41 20.48,31.89 24.89,31.89 PGA257.256

### Text on the board
tNames: top | 192 | 190 | 188 | 186 | 184 | 182 | 180 | 178 | 176 | 174 | 172 | 170 | 168 | 166 | 164 | 162 | 160 | 158 | 156 | 154 | 152 | 150 | 148 | 146 | 144 | 142 | 140 | 138 | 136 | 134 | 132 | 130 | 191 | 189 | 187 | 185 | 183 | 181 | 179 | 177 | 175 | 173 | 171 | 169 | 167 | 165 | 163 | 161 | 159 | 157 | 155 | 153 | 151 | 149 | 147 | 145 | 143 | 141 | 139 | 137 | 135 | 133 | 131 | 129 | 194 | 127 | 193 | 128 | 196 | 195 | 125 | 126 | 198 | 123 | 197 | 124 | 200 | 199 | 121 | 122 | 202 | 119 | 201 | 120 | 204 | 203 | 117 | 118 | 206 | 115 | 205 | 116 | 208 | 207 | 113 | 114 | 210 | 111 | 209 | 112 | 212 | 109 | 211 | 110 | 214 | 213 | 107 | 108 | 216 | 105 | 215 | 106 | 103 | 218 | 217 | 104 | 220 | 101 | 219 | 102 | 222 | 221 | 99 | 100 | 224 | 97 | 223 | 98 | 226 | 95 | 225 | 96 | 228 | 227 | 93 | 94 | 230 | 91 | 229 | 92 | 232 | 231 | 89 | 90 | 234 | 87 | 233 | 88 | 236 | 235 | 85 | 86 | 238 | 83 | 237 | 84 | 240 | 239 | 81 | 82 | 79 | 242 | 241 | 80 | 244 | 77 | 78 | 243 | 75 | 246 | 245 | 76 | 248 | 73 | 247 | 74 | 250 | 249 | 71 | 72 | 252 | 69 | 251 | 70 | 254 | 253 | 67 | 68 | 256 | 65 | 255 | 66 | 1 | 3 | 5 | 7 | 9 | 11 | 13 | 15 | 17 | 19 | 21 | 23 | 25 | 27 | 29 | 31 | 33 | 35 | 37 | 39 | 41 | 43 | 45 | 47 | 49 | 51 | 53 | 55 | 57 | 59 | 61 | 63 | 2 | 4 | 6 | 8 | 10 | 12 | 14 | 16 | 18 | 20 | 22 | 24 | 26 | 28 | 30 | 32 | 34 | 36 | 38 | 40 | 42 | 44 | 46 | 48 | 50 | 52 | 54 | 56 | 58 | 60 | 62 | 64
bNames: bottom | PGA257 SOCKET BOARD | Copyright © UEC Pham Lab 2021 V1.0